# Altium schematic sheet VSENSE_EQ.SchDoc
size A4
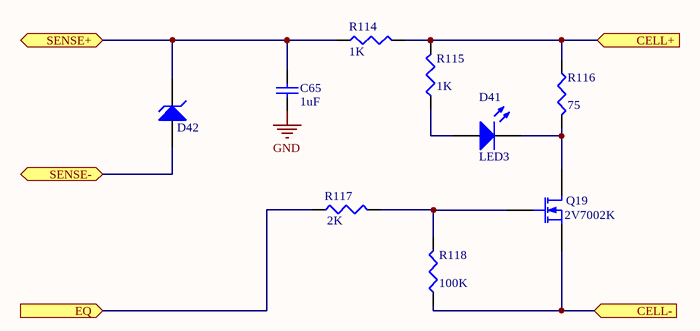
[diagram p0: VSENSE_EQ.SchDoc]

## Parts
C65  value 1uF  [C1206]  (hidden comment: Cap Semi)
D41  LED3  [516-1443-1-ND]
D42  D Zener  [ZENER DIODE]  (value not drawn)
Q19  2V7002K  [N-MOSFET]
R114  value 1K  [0603 RES]  (hidden comment: Res3)
R115  value 1K  [0603 RES]  (hidden comment: Res3)
R116  value 75  [2512 RES]  (hidden comment: Res3)
R117  value 2K  [0603 RES]  (hidden comment: Res3)
R118  value 100K  [0603 RES]  (hidden comment: Res3)

## Ports
CELL+, CELL-, EQ, SENSE+, SENSE-

## Nets
GND: C65.1
CELL+: R114.2 R115.2 R116.1 ; port CELL+
CELL-: Q19.3(S) R118.1 ; port CELL-
EQ: R117.1 ; port EQ
SENSE+: C65.2 D42.2(K) R114.1 ; port SENSE+
SENSE-: D42.1(A) ; port SENSE-
NetD41_1: D41.1(A) R115.1
NetD41_2: D41.2(K) Q19.1(D) R116.2
NetQ19_2: Q19.2(G) R117.2 R118.2

## Library data of the parts
C65 = Cap Semi: Capacitor (Semiconductor SIM Model); Published: 8-Jun-2000; LatestRevisionDate: 29-May-2009; LatestRevisionNote: IPC-7351 Footprint Added.; PackageReference: C1206; Publisher: Altium Limited; PackageDescription: Chip Capacitor
D41 = LED3: Typical BLUE SiC LED; Manufacturer: Broadcom Avago; Manufacturer Part Number: HSMG-C150; Colour: Green,Yellow; Lens Colour: Clear,White; Viewing Angle: 170°; Lens Style: Colorless,Diffused,Rectangular; Luminous Intensity: 15mcd; Forward Voltage: 2.2V; Forward Current: 20mA; Wavelength: 572nm; Lens Transparency: Diffused; Power Dissipation: 65mW; Illumination Colour: Green; Number of Elements: 1; Reverse Voltage: 5V; Published: 8-Jun-2000; LatestRevisionDate: 17-Dec-2003; LatestRevisionNote: PCB Footprint replaced.; DatasheetVersion: 16-Apr-2002; PackageVersion: 16-Apr-2002; PackageReference: 3.5X2.8X1.9; Publisher: Altium Limited; PackageDescription: SM LED; 2 C-Bend Leads; Body 3.5 x 2.8 x 1.9 mm, inc leads (LxWxH typ); Supplier 1: Digi-Key; Supplier Part Number 1: 516-1443-1-ND; Stock 1: 0; Mount: Surface Mount; Case/Package: 1206; Number of Pins: 2; Case Code (Metric): 3216; Case Code (Imperial): 1206; Contact Plating: Gold; Min Operating Temperature: -30°C; Max Operating Temperature: 85°C; Packaging: Tape and Reel; Dominant Wavelength: 572nm; Test Current: 20mA; Package Quantity: 1; Power Rating: 65mW; Max Power Dissipation: 65mW; Number of LEDs: 1; Length: 3.2mm; Height: 1.1mm; Width: 1.6mm; Depth: 1.6mm; Radiation Hardening: No; REACH SVHC: No SVHC
D42 = D Zener: Zener Diode; Manufacturer: Diodes; Manufacturer Part Number: DDZ6V2B-7; Forward Voltage: 900mV; Tolerance: 3%; Max Power Dissipation: 500mW; Zener Voltage: 6.2V; Impedance: 7R; Max Reverse Leakage Current: 500nA; Voltage Tolerance: 2.535%; Test Current: 20mA; Element Configuration: Single; Output Current: 40mA; Published: 8-Jun-2000; LatestRevisionDate: 17-Jul-2002; LatestRevisionNote: Re-released for DXP Platform.; PackageReference: DIODE-0.7; Publisher: Altium Limited; PackageDescription: Diode, Thru-Hole; 2 Leads; 0.7 in Pin Spacing; Supplier 1: Digi-Key; Supplier Part Number 1: DDZ6V2BDICT-ND; Stock 1: 26951; Pricing 1: 1=0.28, 10=0.229, 100=0.1215, 500=0.08, 1000=0.0544 (USD); Mount: Surface Mount; Case/Package: SOD-123-2; Number of Pins: 2; Weight: 0.000353oz; Min Operating Temperature: -65°C; Max Operating Temperature: 150°C; Package Quantity: 3000; Packaging: Tape and Reel; Power Dissipation: 500mW; Zener Current: 500nA; Working Voltage: 6.2V; Peak Reverse Current: 500nA; Termination: SMD/SMT; Power Rating: 500mW; Voltage Rating (DC): 6.2V; Length: 3.85mm; Height: 1.35mm; Width: 1.7mm; Radiation Hardening: No; Lead Free: Lead Free
Q19 = MOSFET-N: N-Channel MOSFET; Manufacturer: ON Semiconductor; Manufacturer Part Number: 2V7002KT1G; Rise Time: 9ns; Rds On Max: 1.6R; Input Capacitance: 24.5pF; Continuous Drain Current (ID): 320mA; Max Power Dissipation: 300mW; Number of Elements: 1; Power Dissipation: 420mW; Turn-On Delay Time: 12.2ns; Turn-Off Delay Time: 55.8ns; Fall Time: 29ns; Threshold Voltage: 1V; Element Configuration: Single; Gate to Source Voltage (Vgs): 20V; Published: 8-Jun-2000; LatestRevisionDate: 17-Jul-2002; LatestRevisionNote: Re-released for DXP Platform.; PackageVersion: 1995/1996; PackageReference: E3; Publisher: Altium Limited; PackageDescription: TO, Flat Index; 3 In-Line, Axial Leads; Body Dia. 4.6mm; Lead Dia. 0.5 mm (max); Supplier 1: Digi-Key; Supplier Part Number 1: 2V7002KT1GOSDKR-ND; Stock 1: 0; Pricing 1: 1=0.29, 10=0.265, 100=0.1484, 500=0.0795, 1000=0.0541 (USD); Case/Package: SOT-23-3; Number of Pins: 3; Contact Plating: Matte,Tin; Min Operating Temperature: -55°C; Max Operating Temperature: 150°C; Package Quantity: 1; Packaging: Tape and Reel; Drain to Source Resistance: 1.6R; Length: 3.04mm; Height: 1.01mm; Width: 1.4mm; Radiation Hardening: No; REACH SVHC: No SVHC; Lead Free: Lead Free; Halogen Free: Halogen Free
R114 R115 R117 R118 = Res3: Resistor; Published: 8-Jun-2000; LatestRevisionDate: 29-May-2009; LatestRevisionNote: IPC-7351 Footprint Added.; PackageReference: J1-0603; Publisher: Altium Limited; PackageDescription: Chip Resistor
R116 = Res3: Resistor; Manufacturer: Vishay Dale; Manufacturer Part Number: CRCW251275R0FKEG; Description: RES SMD 75 OHM 1% 1W 2512; Resistance: 75R; Power Rating: 1W; Tolerance: 1%; Temperature Coefficient: 100ppm/°C; Voltage Rating: 500V; Published: 8-Jun-2000; LatestRevisionDate: 29-May-2009; LatestRevisionNote: IPC-7351 Footprint Added.; PackageReference: J1-0603; Publisher: Altium Limited; PackageDescription: Chip Resistor; Supplier 1: Digi-Key; Supplier Part Number 1: 541-75.0AFCT-ND; Stock 1: 0; Pricing 1: 1=0.39, 10=0.333, 100=0.1301, 1000=0.0545 (USD); Mount: Surface Mount; Case/Package: 2512; Weight: 0.001429oz; Case Code (Imperial): 2512; Case Code (Metric): 6432; Contact Plating: Tin; Min Operating Temperature: -55°C; Max Operating Temperature: 155°C; Packaging: Tape and Reel; Package Quantity: 2000; Composition: Thick Film; Number of Terminations: 2; Military Standard: Not; Max Power Dissipation: 1W; Voltage Rating (DC): 500V; Features: Automotive AEC-Q200; Termination: SMD/SMT; Length: 6.3mm; Height: 0.6mm; Width: 3.15mm; Depth: 3.15mm; Radiation Hardening: No; Lead Free: Lead Free; REACH SVHC: Unknown